# EAGLE schematic tile-controller (EAGLE 8.1.0)
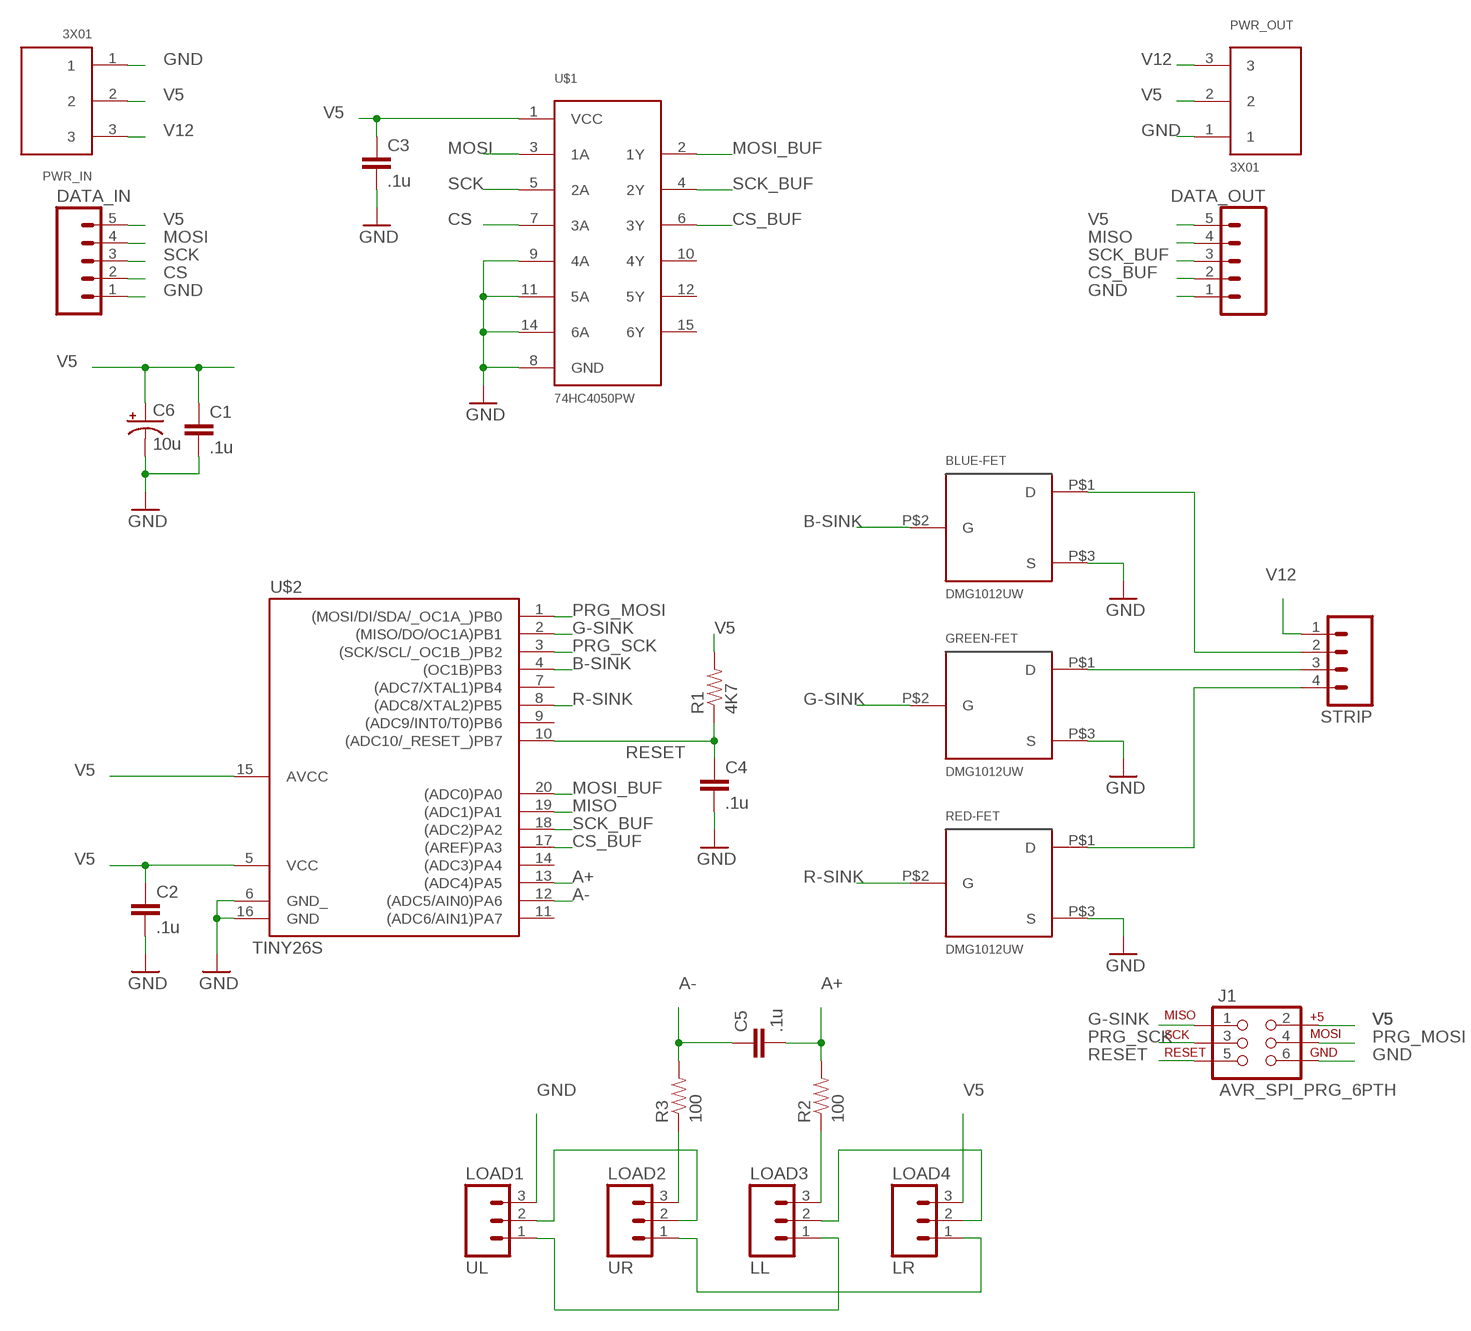
[diagram p0: schematic, sheet 1]

## Parts
BLUE-FET  DMG1012UW  [SOT-323]
C1  .1u  CAP0805  [0805]
C2  .1u  CAP0805  [0805]
C3  .1u  CAP0805  [0805]
C4  .1u  CAP0805  [0805]
C5  .1u  CAP0805  [0805]
C6  10u  CAP_POL1206  [EIA3216]
DATA_IN  M05PTH  [1X05]
DATA_OUT  M05PTH  [1X05]
GREEN-FET  DMG1012UW  [SOT-323]
J1  AVR_SPI_PRG_6PTH  [2X3]
LOAD1  UL  M03PTH  [1X03]
LOAD2  UR  M03PTH  [1X03]
LOAD3  LL  M03PTH  [1X03]
LOAD4  LR  M03PTH  [1X03]
PWR_IN  3X01  [3X01-18AWG]
PWR_OUT  3X01  [3X01-18AWG]
R1  4K7  RESISTOR  [0805]
R2  100  RESISTOR  [0805]
R3  100  RESISTOR  [0805]
RED-FET  DMG1012UW  [SOT-323]
STRIP  M04PTH  [1X04]
U$1  74HC4050PW  [TSSOP16.2]
U$2  TINY26S  [SO20L$]

## Nets
_1: LOAD2.3 R3.1
_2: LOAD3.3 R2.1
A+: C5.2 R2.2 U$2.13((ADC4)PA5)
A-: C5.1 R3.2 U$2.12((ADC5/AIN0)PA6)
B-SINK: BLUE-FET.P$2(G) U$2.4((OC1B)PB3)
CS: DATA_IN.2 U$1.7(3A)
CS_BUF: DATA_OUT.2 U$1.6(3Y) U$2.17((AREF)PA3)
G-SINK: GREEN-FET.P$2(G) J1.1 U$2.2((MISO/DO/OC1A)PB1)
GND: BLUE-FET.P$3(S) C1.2 C2.2 C3.2 C4.2 C6.C(-) DATA_IN.1 DATA_OUT.1 GREEN-FET.P$3(S) J1.6 LOAD1.3 PWR_IN.1 PWR_OUT.1 RED-FET.P$3(S) U$1.8(GND) U$1.9(4A) U$1.11(5A) U$1.14(6A) U$2.6(GND_) U$2.16(GND)
MISO: DATA_OUT.4 U$2.19((ADC1)PA1)
MOSI: DATA_IN.4 U$1.3(1A)
MOSI_BUF: U$1.2(1Y) U$2.20((ADC0)PA0)
N$2: LOAD1.1 LOAD3.1
N$3: LOAD2.1 LOAD4.1
N$4: GREEN-FET.P$1(D) STRIP.3
N$5: BLUE-FET.P$1(D) STRIP.2
N$6: RED-FET.P$1(D) STRIP.4
N$7: LOAD1.2 LOAD2.2
N$8: LOAD3.2 LOAD4.2
PRG_MOSI: J1.4 U$2.1((MOSI/DI/SDA/_OC1A_)PB0)
PRG_SCK: J1.3 U$2.3((SCK/SCL/_OC1B_)PB2)
R-SINK: RED-FET.P$2(G) U$2.8((ADC8/XTAL2)PB5)
RESET: C4.1 J1.5 R1.1 U$2.10((ADC10/_RESET_)PB7)
SCK: DATA_IN.3 U$1.5(2A)
SCK_BUF: DATA_OUT.3 U$1.4(2Y) U$2.18((ADC2)PA2)
V5: C1.1 C2.1 C3.1 C6.A(+) DATA_IN.5 DATA_OUT.5 J1.2 LOAD4.3 PWR_IN.2 PWR_OUT.2 R1.2 U$1.1(VCC) U$2.5(VCC) U$2.15(AVCC)
V12: PWR_IN.3 PWR_OUT.3 STRIP.1
Unconnected: U$1.10(4Y) U$1.12(5Y) U$1.15(6Y) U$2.7((ADC7/XTAL1)PB4) U$2.9((ADC9/INT0/T0)PB6) U$2.11((ADC6/AIN1)PA7) U$2.14((ADC3)PA4)

## Library data of the parts
BLUE-FET GREEN-FET RED-FET = GARTH:DMG1012UW: N-CHANNEL ENHANCEMENT MODE MOSFET
C1-C5 = SparkFun:CAP: Capacitor Standard 0603 ceramic capacitor, and 0.1" leaded capacitor.
C6 = SparkFun:CAP_POL: Capacitor Polarized These are standard SMD and PTH capacitors. Normally 10uF, 47uF, and 100uF in electrolytic and tantalum varieties. Always verify the external diameter of the through hole cap, it varies with capacity, voltage, and manufacturer. The EIA devices should be standard.
DATA_IN DATA_OUT = SparkFun-Connectors:M05: Header 5 Standard 5-pin 0.1" header. Use with straight break away headers (SKU : PRT-00116), right angle break away headers (PRT-00553), swiss pins (PRT-00743), machine pins (PRT-00117), and female headers (PRT-00115). Molex polarized connector foot print use with SKU : PRT-08230 with associated crimp pins and housings.
J1 = SparkFun-Connectors:AVR_SPI_PRG_6: AVR ISP 6 Pin This is the reduced ISP connector for AVR programming. Common on Arduino. This footprint will take up less PCB space and can be used with a 10-pin to 6-pin adapter such as SKU: BOB-08508
LOAD1-LOAD4 = SparkFun-Connectors:M03: Header 3 Standard 3-pin 0.1" header. Use with straight break away headers (SKU : PRT-00116), right angle break away headers (PRT-00553), swiss pins (PRT-00743), machine pins (PRT-00117), and female headers (PRT-00115). Molex polarized connector foot print use with SKU : PRT-08232 with associated crimp pins and housings.
PWR_IN PWR_OUT = GARTH:3X01
R1-R3 = SparkFun:RESISTOR: Resistor Basic schematic elements and footprints for 0603, 1206, and PTH 1/10th watt (small) resistors.
STRIP = SparkFun-Connectors:M04: Header 4 Standard 4-pin 0.1" header. Use with straight break away headers (SKU : PRT-00116), right angle break away headers (PRT-00553), swiss pins (PRT-00743), machine pins (PRT-00117), and female headers (PRT-00115). Molex polarized connector foot print use with SKU : PRT-08231 with associated crimp pins and housings. 1MM SMD Version SKU: PRT-10208
U$1 = GARTH:74HC4050: High-Speed CMOS Logic, Non-Inverting Hex Buffers
U$2 = avr-7:TINY26: Atmel Tiny26/261/461/861